# Altium schematic sheet hand_bot.SchDoc (part 1 of 2)
size 594 x 420 mm; DecimalNumber: XXXXXX.XXXЭ3; Name: Главная плата управления; ApprovedBy: {Утвердил}; CheckedBy: {Проверил}; DrawnBy: Соловьев; Engineer: {Инженер}; DocumentNumber: {Обозначение}; SheetTotal: 1; Title1str: Главная плата; PageSetup: Record=PageOptions|CenterHorizontal=False|CenterVertical=False|PrintScale=0.33|XCorrection=0.00|YCorrection=0.00|PrintKind=1|BorderSize=5000000|LeftOffset=0|BottomOffset=0|Orientation=1|PaperLength=1000|PaperWidth=1000|Scale=100|PaperSource=15|PrintQuality=600|MediaType=1|DitherType=10|PaperKind=A4|PrintScaleMode=1; Title2str: управления; ProcessInspection: {Т.контр.}; NormInspection: {Н.контр.}; EngineerName: {Инженер}; DocumentType1str: схема электрическая; DocumentType2str: принципиальная; MainDevice: Неопределённый узел РАВС...; ImagePath: {Перв. применение}; Rule: PcbType=ProtelPcb
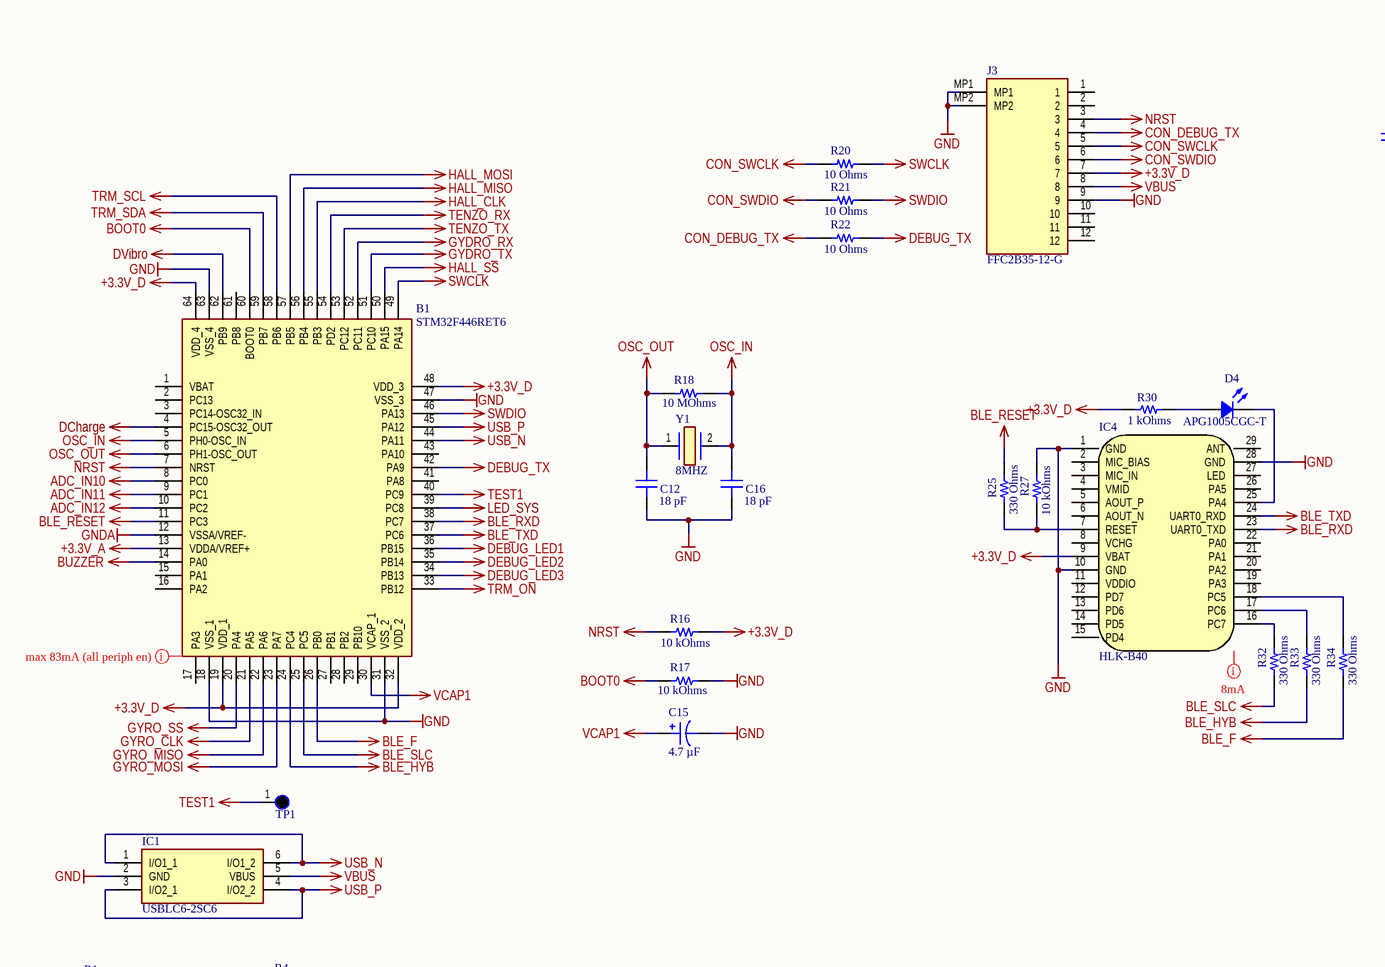
[diagram p0: hand_bot.SchDoc, top left]
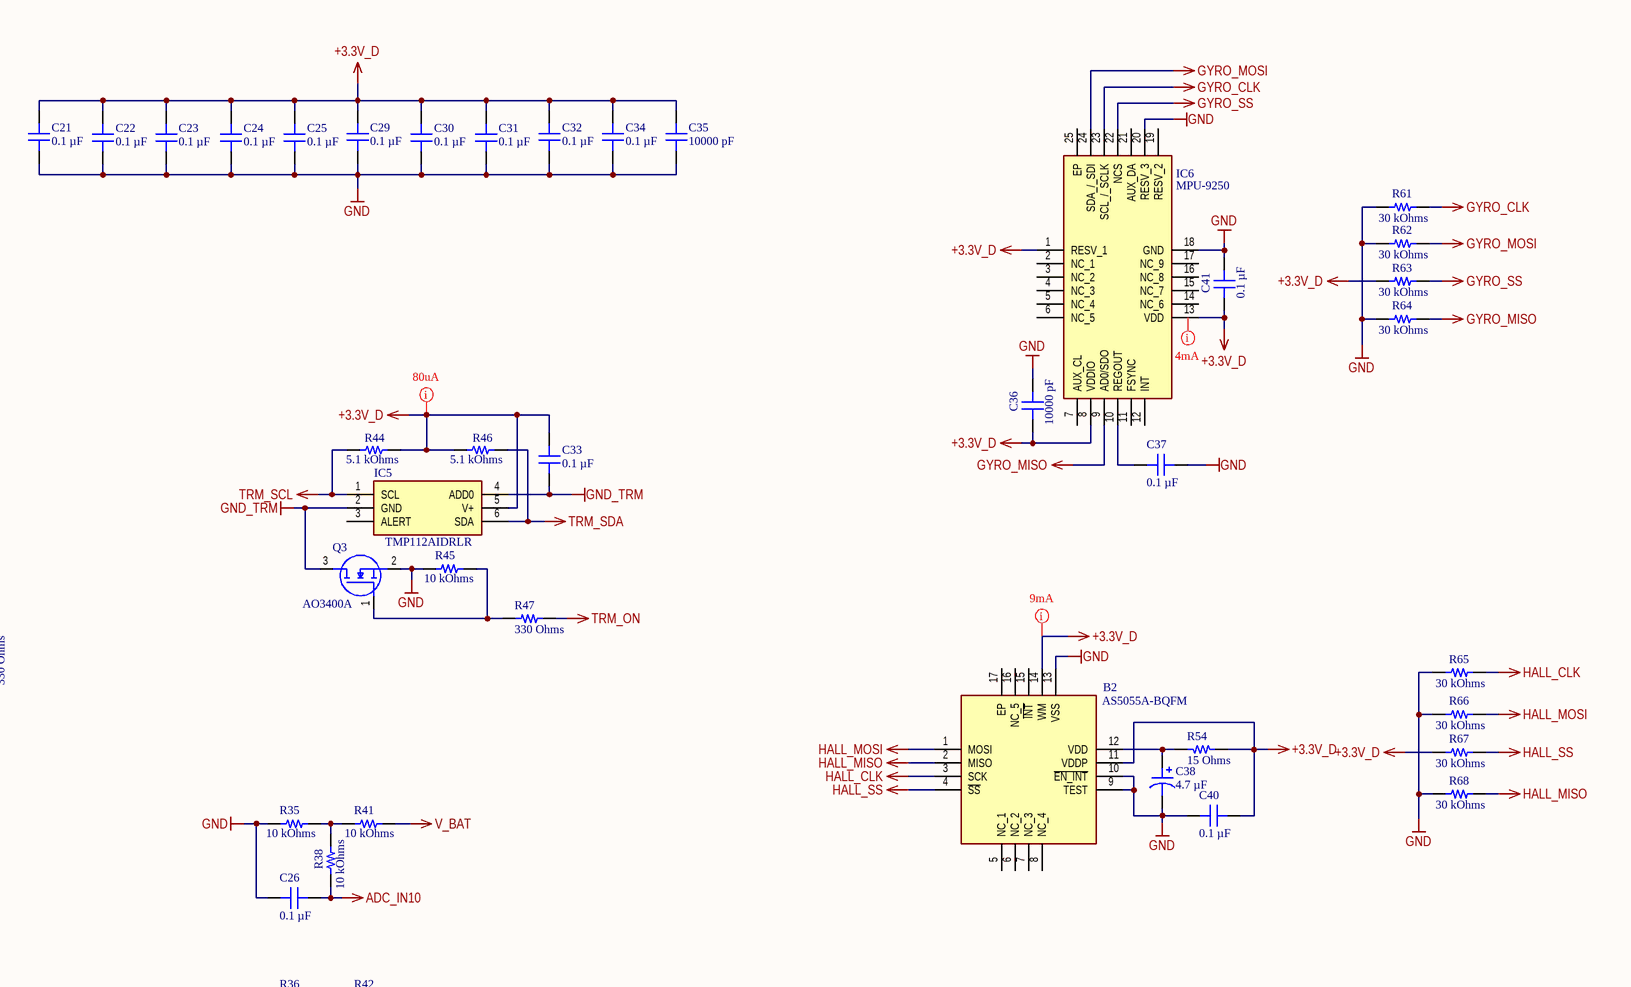
[diagram p1: hand_bot.SchDoc, top right]
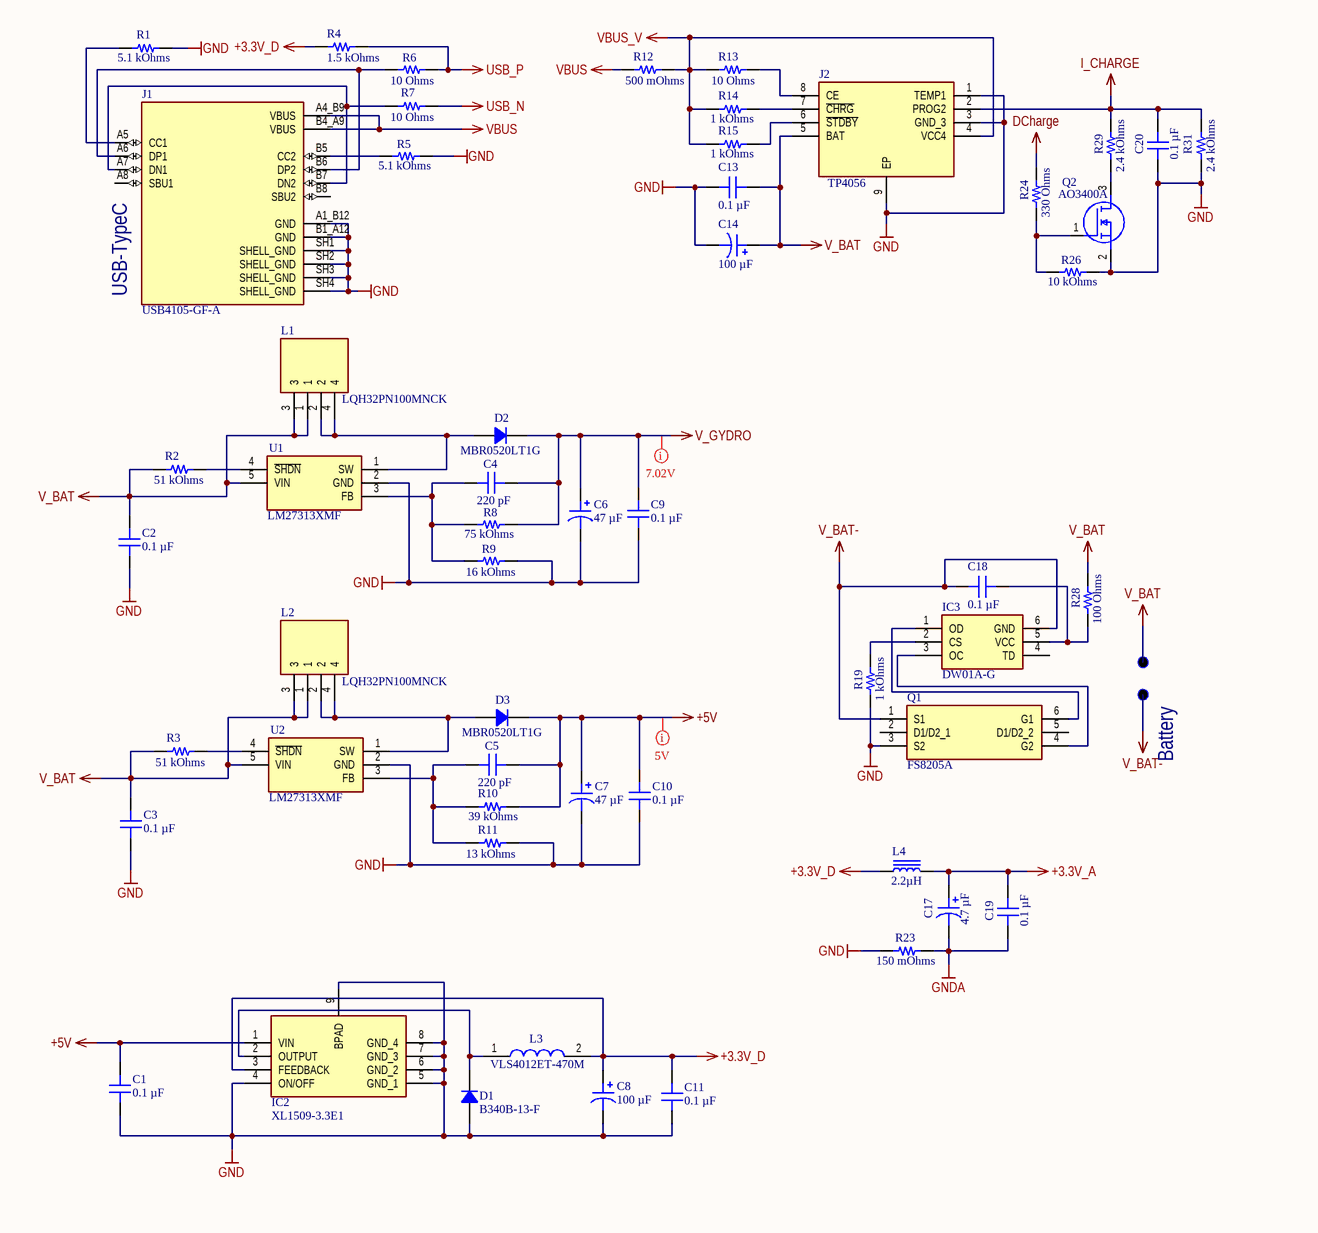
[diagram p2: hand_bot.SchDoc, bottom left]
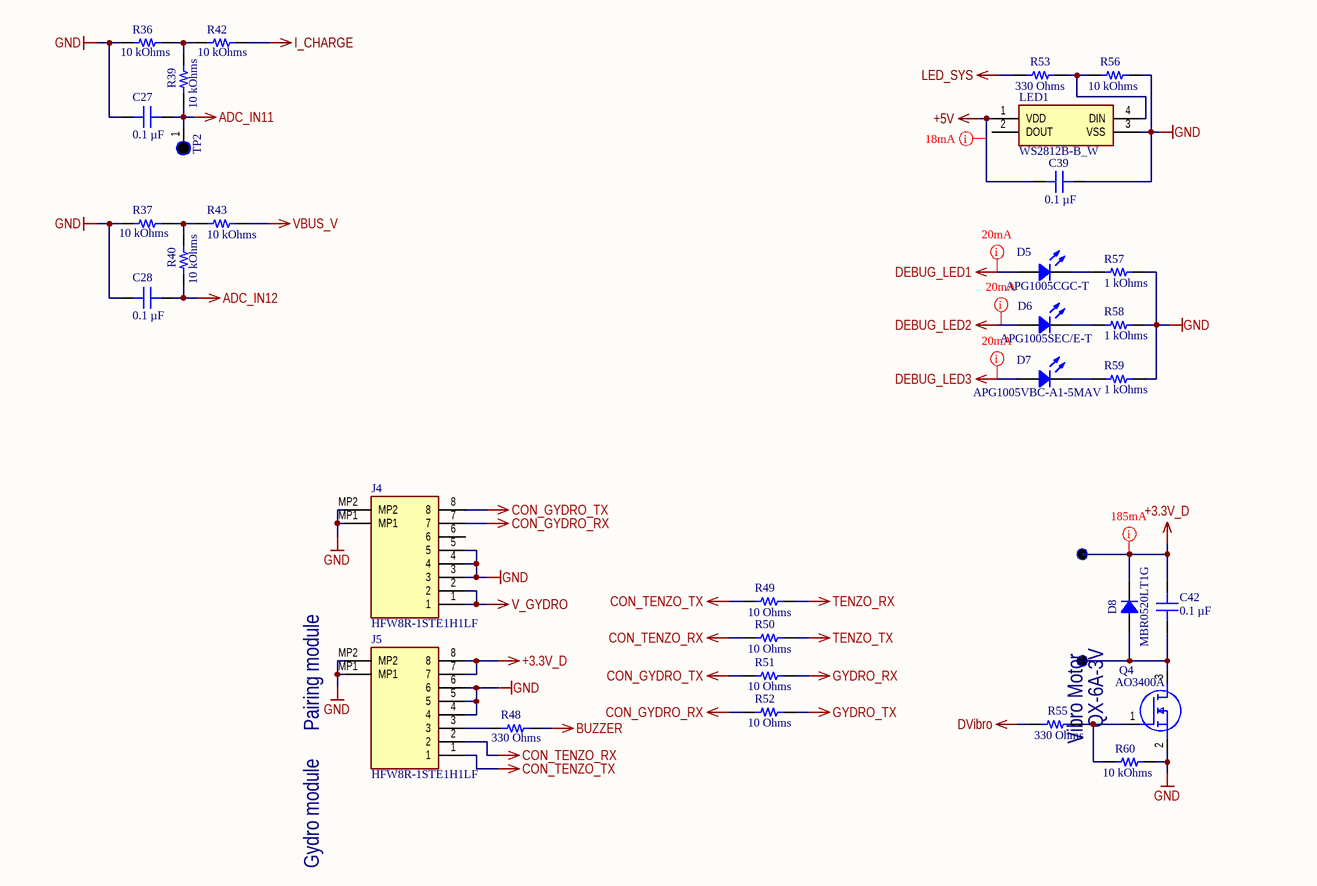
[diagram p3: hand_bot.SchDoc, bottom right]

## Parts
B1  STM32F446RET6  [QFP50P1200X1200X160-64N]
B2  AS5055A-BQFM  [QFN65P400X400X100-17N-D]
C1  0.1 µF  [CAP 0402_1005]
C2  0.1 µF  [CAP 0402_1005]
C3  0.1 µF  [CAP 0402_1005]
C4  220 pF  [CAP 0402_1005]
C5  220 pF  [CAP 0402_1005]
C6  47 µF  [CAP POL 1411_3528]
C7  47 µF  [CAP POL 1411_3528]
C8  100 µF  [CAP POL 1411_3528]
C9  0.1 µF  [CAP 0402_1005]
C10  0.1 µF  [CAP 0402_1005]
C11  0.1 µF  [CAP 0402_1005]
C12  18 pF  [CAP 0402_1005]
C13  0.1 µF  [CAP 0402_1005]
C14  100 µF  [CAP POL 1411_3528]
C15  4.7 µF  [CAP POL 1206_3216]
C16  18 pF  [CAP 0402_1005]
C17  4.7 µF  [CAP POL 1206_3216]
C18  0.1 µF  [CAP 0402_1005]
C19  0.1 µF  [CAP 0402_1005]
C20  0.1 µF  [CAP 0402_1005]
C21  0.1 µF  [CAP 0402_1005]
C22  0.1 µF  [CAP 0402_1005]
C23  0.1 µF  [CAP 0402_1005]
C24  0.1 µF  [CAP 0402_1005]
C25  0.1 µF  [CAP 0402_1005]
C26  0.1 µF  [CAP 0402_1005]
C27  0.1 µF  [CAP 0402_1005]
C28  0.1 µF  [CAP 0402_1005]
C29  0.1 µF  [CAP 0402_1005]
C30  0.1 µF  [CAP 0402_1005]
C31  0.1 µF  [CAP 0402_1005]
C32  0.1 µF  [CAP 0402_1005]
C33  0.1 µF  [CAP 0402_1005]
C34  0.1 µF  [CAP 0402_1005]
C35  10000 pF  [CAP 0402_1005]
C36  10000 pF  [CAP 0402_1005]
C37  0.1 µF  [CAP 0402_1005]
C38  4.7 µF  [CAP POL 1206_3216]
C39  0.1 µF  [CAP 0402_1005]
C40  0.1 µF  [CAP 0402_1005]
C41  0.1 µF  [CAP 0402_1005]
C42  0.1 µF  [CAP 0402_1005]
D1  B340B-13-F  [DO214AA SMB]
D2  MBR0520LT1G  [SOD-123]
D3  MBR0520LT1G  [SOD-123]
D4  APG1005CGC-T  [LED 0402_1005 GREEN]
D5  APG1005CGC-T  [LED 0402_1005 GREEN]
D6  Part Number: APG1005SEC/E-T  [LED 0402_1005 RED]  (hidden comment: Red)
D7  Part Number: APG1005VBC-A1-5MAV  [LED 0402_1005 BLUE]  (hidden comment: Blue)
D8  MBR0520LT1G  [SOD-123]
IC1  USBLC6-2SC6  [SOT95P280X145-6N]
IC2  XL1509-3.3E1  [SOIC127P600X175-8N_BPAD]
IC3  DW01A-G  [SOT95P280X135-6N]
IC4  HLK-B40  [hlk-b40]
IC5  TMP112AIDRLR  [SOTFL50P160X60-6N]
IC6  MPU-9250  [QFN40P300X300X105-25N-D]
J1  USB4105-GF-A  [GCT_USB4105-GF-A]
J2  TP4056  [SOIC127P600X175-9N]
J3  FFC2B35-12-G  [FFC2B3512G]
J4  HFW8R-1STE1H1LF  [HFW8R1STE1H1LF]
J5  HFW8R-1STE1H1LF  [HFW8R1STE1H1LF]
L1  LQH32PN100MNCK  [LQH32CH100K53L]
L2  LQH32PN100MNCK  [LQH32CH100K53L]
L3  VLS4012ET-470M  [VLS4012]
L4  2.2µH  [IND 0603_1608 RF WW]
LED1  WS2812B-B_W  [WS2812BBW]
Q1  FS8205A  [SOT95P280X125-6N]
Q2  AO3400A  [SOT95P280X125-3N]
Q3  AO3400A  [SOT95P280X125-3N]
Q4  AO3400A  [SOT95P280X125-3N]
R1  5.1 kOhms  [RES 0402_1005]
R2  51 kOhms  [RES 0402_1005]
R3  51 kOhms  [RES 0402_1005]
R4  1.5 kOhms  [RES 0402_1005]
R5  5.1 kOhms  [RES 0402_1005]
R6  10 Ohms  [RES 0402_1005]
R7  10 Ohms  [RES 0402_1005]
R8  75 kOhms  [RES 0402_1005]
R9  16 kOhms  [RES 0402_1005]
R10  39 kOhms  [RES 0402_1005]
R11  13 kOhms  [RES 0402_1005]
R12  500 mOhms  [RES 2512_6432]
R13  10 Ohms  [RES 0402_1005]
R14  1 kOhms  [RES 0402_1005]
R15  1 kOhms  [RES 0402_1005]
R16  10 kOhms  [RES 0402_1005]
R17  10 kOhms  [RES 0402_1005]
R18  10 MOhms  [RES 0402_1005]
R19  1 kOhms  [RES 0402_1005]
R20  10 Ohms  [RES 0402_1005]
R21  10 Ohms  [RES 0402_1005]
R22  10 Ohms  [RES 0402_1005]
R23  150 mOhms  [RES 0805_2012]
R24  330 Ohms  [RES 0402_1005]
R25  330 Ohms  [RES 0402_1005]
R26  10 kOhms  [RES 0402_1005]
R27  10 kOhms  [RES 0402_1005]
R28  100 Ohms  [RES 0402_1005]
R29  2.4 kOhms  [RES 0402_1005]
R30  1 kOhms  [RES 0402_1005]
R31  2.4 kOhms  [RES 0402_1005]
R32  330 Ohms  [RES 0402_1005]
R33  330 Ohms  [RES 0402_1005]
R34  330 Ohms  [RES 0402_1005]
R35  10 kOhms  [RES 0402_1005]
R36  10 kOhms  [RES 0402_1005]
R37  10 kOhms  [RES 0402_1005]
R38  10 kOhms  [RES 0402_1005]
R39  10 kOhms  [RES 0402_1005]
R40  10 kOhms  [RES 0402_1005]
R41  10 kOhms  [RES 0402_1005]
R42  10 kOhms  [RES 0402_1005]
R43  10 kOhms  [RES 0402_1005]
R44  5.1 kOhms  [RES 0402_1005]
R45  10 kOhms  [RES 0402_1005]
R46  5.1 kOhms  [RES 0402_1005]
R47  330 Ohms  [RES 0402_1005]
R48  330 Ohms  [RES 0402_1005]
R49  10 Ohms  [RES 0402_1005]
R50  10 Ohms  [RES 0402_1005]
R51  10 Ohms  [RES 0402_1005]
R52  10 Ohms  [RES 0402_1005]
R53  330 Ohms  [RES 0402_1005]
R54  15 Ohms  [RES 0603_1608]
R55  330 Ohms  [RES 0402_1005]
R56  10 kOhms  [RES 0402_1005]
R57  1 kOhms  [RES 0402_1005]
R58  1 kOhms  [RES 0402_1005]
R59  1 kOhms  [RES 0402_1005]
R60  10 kOhms  [RES 0402_1005]
R61  30 kOhms  [RES 0402_1005]
R62  30 kOhms  [RES 0402_1005]
R63  30 kOhms  [RES 0402_1005]
R64  30 kOhms  [RES 0402_1005]
R65  30 kOhms  [RES 0402_1005]
R66  30 kOhms  [RES 0402_1005]
R67  30 kOhms  [RES 0402_1005]
R68  30 kOhms  [RES 0402_1005]
TP1  TestPoint  [TestPoint1]  (value not drawn)  (no BOM)
TP2  TestPoint  [TestPoint1]  (value not drawn)  (no BOM)
U1  LM27313XMF  [SOT95P280X145-5N]
U2  LM27313XMF  [SOT95P280X145-5N]
Y1  8MHZ  [NX3225GD8MHZSTDCRA3]

## Nets
+3.3V_A: B1.13(VDDA/VREF+) C17.1 C19.2 L4.2
+3.3V_D: B1.19(VDD_1) B1.32(VDD_2) B1.48(VDD_3) B1.64(VDD_4) B2.11(VDDP) B2.14(WM) C8.1 C11.2 C21.2 C22.2 C23.2 C24.2 C25.2 C29.2 C30.2 C31.2 C32.2 C33.2 C34.2 C35.2 C36.1 C40.1 C41.1 C42.2 D8.2 IC2.3(FEEDBACK) IC4.9(VBAT) IC5.5(V+) IC6.1(RESV_1) IC6.8(VDDIO) IC6.13(VDD) J3.7 J5.7 J5.8 L3.2 L4.1 R4.2 R16.2 R30.1 R44.2 R46.1 R54.2 R63.1 R67.1
+5V: C1.2 C5.2 C7.1 C10.2 C39.2 D3.2 IC2.1(VIN) LED1.1(VDD) R10.2
ADC_IN10: B1.8(PC0) C26.1 R38.1
ADC_IN11: B1.9(PC1) C27.1 R39.1 TP2.1
ADC_IN12: B1.10(PC2) C28.1 R40.1
BLE_F: B1.26(PB0) R34.1
BLE_HYB: B1.24(PC4) R33.1
BLE_RESET: B1.11(PC3) R25.2
BLE_RXD: B1.38(PC7) IC4.23(UART0_TXD)
BLE_SLC: B1.25(PC5) R32.1
BLE_TXD: B1.37(PC6) IC4.24(UART0_RXD)
BOOT0: B1.60(BOOT0) R17.1
BUZZER: B1.14(PA0) R48.1
CON_DEBUG_TX: J3.4 R22.1
CON_GYDRO_RX: J4.7 R52.1
CON_GYDRO_TX: J4.8 R51.1
CON_SWCLK: J3.5 R20.1
CON_SWDIO: J3.6 R21.1
CON_TENZO_RX: J5.2 R50.1
CON_TENZO_TX: J5.1 R49.1
DCharge: B1.4(PC15-OSC32_OUT) R24.2
DEBUG_LED1: B1.36(PB15) D5.1
DEBUG_LED2: B1.35(PB14) D6.1
DEBUG_LED3: B1.34(PB13) D7.1
DEBUG_TX: B1.42(PA9) R22.2
DVibro: B1.62(PB9) R55.2
GND: B1.18(VSS_1) B1.31(VSS_2) B1.47(VSS_3) B1.63(VSS_4) B2.9(TEST) B2.10(~{EN_INT}) B2.13(VSS) C1.1 C2.1 C3.1 C6.2 C7.2 C8.2 C9.1 C10.1 C11.1 C12.1 C13.1 C14.2 C15.2 C16.1 C20.1 C21.1 C22.1 C23.1 C24.1 C25.1 C26.2 C27.2 C28.2 C29.1 C30.1 C31.1 C32.1 C34.1 C35.1 C36.2 C37.1 C38.2 C39.1 C40.2 C41.2 D1.1 IC1.2(GND) IC2.4(ON/OFF) IC2.5(GND_1) IC2.6(GND_2) IC2.7(GND_3) IC2.8(GND_4) IC2.9(BPAD) IC4.1(GND) IC4.10(GND) IC4.28(GND) IC6.18(GND) IC6.20(RESV_3) J1.A1_B12(GND) J1.B1_A12(GND) J1.SH1(SHELL_GND) J1.SH2(SHELL_GND) J1.SH3(SHELL_GND) J1.SH4(SHELL_GND) J2.1(TEMP1) J2.3(GND_3) J2.9(EP) J3.9 J3.MP1 J3.MP2 J4.3 J4.4 J4.5 J4.MP1 J4.MP2 J5.4 J5.5 J5.6 J5.MP1 J5.MP2 LED1.3(VSS) Q1.3(S2) Q2.2(S) Q3.2(S) Q4.2(S) R1.2 R5.2 R9.2 R11.2 R17.2 R19.1 R23.1 R26.2 R27.2 R31.1 R35.1 R36.1 R37.1 R45.1 R56.2 R57.2 R58.2 R59.2 R60.2 R61.1 R62.1 R64.1 R65.1 R66.1 R68.1 U1.2(GND) U2.2(GND)
GND_TRM: C33.1 IC5.2(GND) IC5.4(ADD0) Q3.3(D)
GNDA: B1.12(VSSA/VREF-) C17.2 C19.1 R23.2
GYDRO_RX: B1.52(PC11) R51.2
GYDRO_TX: B1.51(PC10) R52.2
GYRO_CLK: B1.21(PA5) IC6.23(SCL_/_SCLK) R61.2
GYRO_MISO: B1.22(PA6) IC6.9(AD0/SDO) R64.2
GYRO_MOSI: B1.23(PA7) IC6.24(SDA_/_SDI) R62.2
GYRO_SS: B1.20(PA4) IC6.22(NCS) R63.2
HALL_CLK: B1.55(PB3) B2.3(SCK) R65.2
HALL_MISO: B1.56(PB4) B2.2(MISO) R68.2
HALL_MOSI: B1.57(PB5) B2.1(MOSI) R66.2
HALL_SS: B1.50(PA15) B2.4(~{SS}) R67.2
I_CHARGE: C20.2 J2.2(PROG2) R29.2 R31.2 R42.2
LED_SYS: B1.39(PC8) R53.1
NRST: B1.7(NRST) J3.3 R16.1
OSC_IN: B1.5(PH0-OSC_IN) C16.2 R18.2 Y1.2
OSC_OUT: B1.6(PH1-OSC_OUT) C12.2 R18.1 Y1.1
SWCLK: B1.49(PA14) R20.2
SWDIO: B1.46(PA13) R21.2
TENZO_RX: B1.54(PD2) R49.2
TENZO_TX: B1.53(PC12) R50.2
TEST1: B1.40(PC9) TP1.1
TRM_ON: B1.33(PB12) R47.2
TRM_SCL: B1.58(PB6) IC5.1(SCL) R44.1
TRM_SDA: B1.59(PB7) IC5.6(SDA) R46.2
USB_N: B1.44(PA11) IC1.1(I/O1_1) IC1.6(I/O1_2) R7.2
USB_P: B1.45(PA12) IC1.3(I/O2_1) IC1.4(I/O2_2) R4.1 R6.2
V_BAT: C2.2 C3.2 C13.2 C14.1 J2.5(BAT) L1.1 L1.3 L2.1 L2.3 R2.1 R3.1 R28.2 R41.2 U1.5(VIN) U2.5(VIN)
V_BAT-: C18.2 IC3.6(GND) Q1.1(S1)
V_GYDRO: C4.2 C6.1 C9.2 D2.2 J4.1 J4.2 R8.2
VBUS: IC1.5(VBUS) J1.A4_B9(VBUS) J1.B4_A9(VBUS) J3.8 R12.1
VBUS_V: J2.4(VCC4) R12.2 R13.1 R14.1 R15.1 R43.2
VCAP1: B1.30(VCAP_1) C15.1
NetB2_12: B2.12(VDD) C38.1 R54.1
NetC4_1: C4.1 R8.1 R9.1 U1.3(FB)
NetC5_1: C5.1 R10.1 R11.1 U2.3(FB)
NetC18_1: C18.1 IC3.5(VCC) R28.1
NetC37_2: C37.2 IC6.10(REGOUT)
NetC42_1: C42.1 D8.1 Q4.3(D)
NetD1_2: D1.2 IC2.2(OUTPUT) L3.1
NetD2_1: D2.1 L1.2 L1.4 U1.1(SW)
NetD3_1: D3.1 L2.2 L2.4 U2.1(SW)
NetD4_1: D4.1 R30.2
NetD4_2: D4.2 IC4.25(PA4)
NetD5_2: D5.2 R57.1
NetD6_2: D6.2 R58.1
NetD7_2: D7.2 R59.1
NetIC3_1: IC3.1(OD) Q1.6(G1)
NetIC3_2: IC3.2(CS) R19.2
NetIC3_3: IC3.3(OC) Q1.4(G2)
NetIC4_7: IC4.7(RESET) R25.1 R27.1
NetIC4_16: IC4.16(PC7) R32.2
NetIC4_17: IC4.17(PC6) R33.2
NetIC4_18: IC4.18(PC5) R34.2
NetJ1_A5: J1.A5(CC1) R1.1
NetJ1_A6: J1.A6(DP1) J1.B6(DP2) R6.1
NetJ1_A7: J1.A7(DN1) J1.B7(DN2) R7.1
NetJ1_B5: J1.B5(CC2) R5.1
NetJ2_6: J2.6(~{STDBY}) R15.2
NetJ2_7: J2.7(~{CHRG}) R14.2
NetJ2_8: J2.8(CE) R13.2
NetJ5_3: J5.3 R48.2
NetLED1_4: LED1.4(DIN) R53.2 R56.1
NetQ2_1: Q2.1(G) R24.1 R26.1
NetQ2_3: Q2.3(D) R29.1
NetQ3_1: Q3.1(G) R45.2 R47.1
NetQ4_1: Q4.1(G) R55.1 R60.1
NetR2_2: R2.2 U1.4(~{SHDN})
NetR3_2: R3.2 U2.4(~{SHDN})
NetR35_2: R35.2 R38.2 R41.1
NetR36_2: R36.2 R39.2 R42.1
NetR37_2: R37.2 R40.2 R43.1

Not connected (* = marked no-connect by the designer): B1 1(VBAT) 2(PC13) 3(PC14-OSC32_IN) 15(PA1) 16(PA2) 17(PA3) 27(PB1) 28(PB2) 29(PB10) 41(PA8) 43(PA10) 61(PB8); B2 5(NC_1) 6(NC_2) 7(NC_3) 8(NC_4) 15(~{INT}) 16(NC_5) 17(EP); IC3 4(TD); IC4 2(MIC_BIAS) 3(MIC_IN) 4(VMID) 5(AOUT_P) 6(AOUT_N) 8(VCHG) 11(VDDIO) 12(PD7) 13(PD6) 14(PD5) 15(PD4) 19(PA3) 20(PA2) 21(PA1) 22(PA0) 26(PA5) 27(LED) 29(ANT); IC5 3(ALERT); IC6 2(NC_1) 3(NC_2) 4(NC_3) 5(NC_4) 6(NC_5) 7(AUX_CL) 11(FSYNC) 12(INT) 14(NC_6) 15(NC_7) 16(NC_8) 17(NC_9) 19(RESV_2) 21(AUX_DA) 25(EP); J1 A8(SBU1) B8(SBU2); J3 1 2 10 11 12; J4 6; LED1 2(DOUT); Q1 2(D1/D2_1) 5(D1/D2_2)

## Layout directives
mark named 80uA: +3.3V_D
mark named 9mA: +3.3V_D
mark named 185mA: +3.3V_D
mark named max 83mA (all periph en): (no net found under the mark)
mark named 4mA: (no net found under the mark)
mark named 7.02V: V_GYDRO
mark named 5V: +5V
mark named 18mA: +5V
mark named 20mA: DEBUG_LED1, DEBUG_LED2, DEBUG_LED3
mark named 8mA: (no net found under the mark)

## Notes on the sheet
- (near J1) USB-TypeC
- Pairing module
- Battery
- Vibro Motor
- (near D8) QX-6A-3V
- Gydro module
- Перв. примен.
- Справ. №
- Подп. и дата
- Инв. № дубл.
- Взам. инв. №
- Изм.
- Лист
- № докум.
- Подп.
- Дата
- Лит.
- Масса
- Масштаб
- Т.контр.
- Пров.
- Разраб.
- Листов
- Инв. № подл.
- Н.контр.
- Утв.
- Копировал
- Формат А2